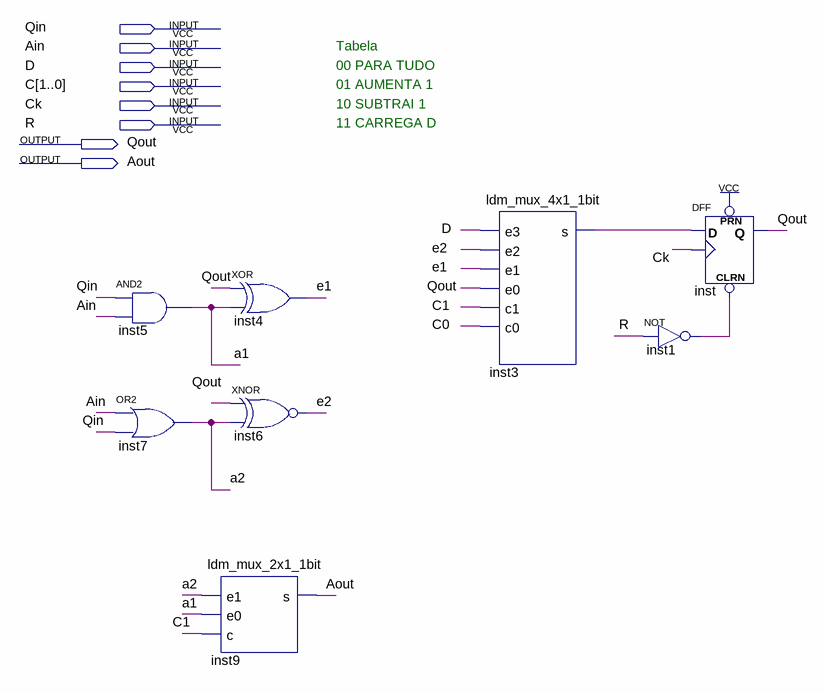
[diagram p0: schematic sheet]
// Quartus schematic ldm_counter_1bit.bdf as structural Verilog: 8 symbols, 8 pins
module ldm_counter_1bit (
  input  Qin,
  input  Ain,
  input  D,
  input  [1:0] C,
  input  Ck,
  input  R,
  output Qout,
  output Aout
);

  wire a1, a2, e1, e2, inst1_out, inst3_s;

  and inst5 (a1, Qin, Ain);
  or inst7 (a2, Ain, Qin);
  xor inst4 (e1, Qout, a1);
  xnor inst6 (e2, Qout, a2);
  ldm_mux_2x1_1bit inst9 (.e1(a2), .e0(a1), .c(C[1]), .s(Aout));
  ldm_mux_4x1_1bit inst3 (.e3(D), .e2(e2), .e1(e1), .e0(Qout), .c1(C[1]), .c0(C[0]), .s(inst3_s));
  not inst1 (inst1_out, R);
  DFF inst (.CLRN(inst1_out), .CLK(Ck), .D(inst3_s), .PRN(1'b1), .Q(Qout));

  // Notes on the sheet:
  //   Tabela
  //   00 PARA TUDO
  //   01 AUMENTA 1
  //   10 SUBTRAI 1
  //   11 CARREGA D
endmodule
